# EAGLE design electronics (EAGLE 7.6.0)
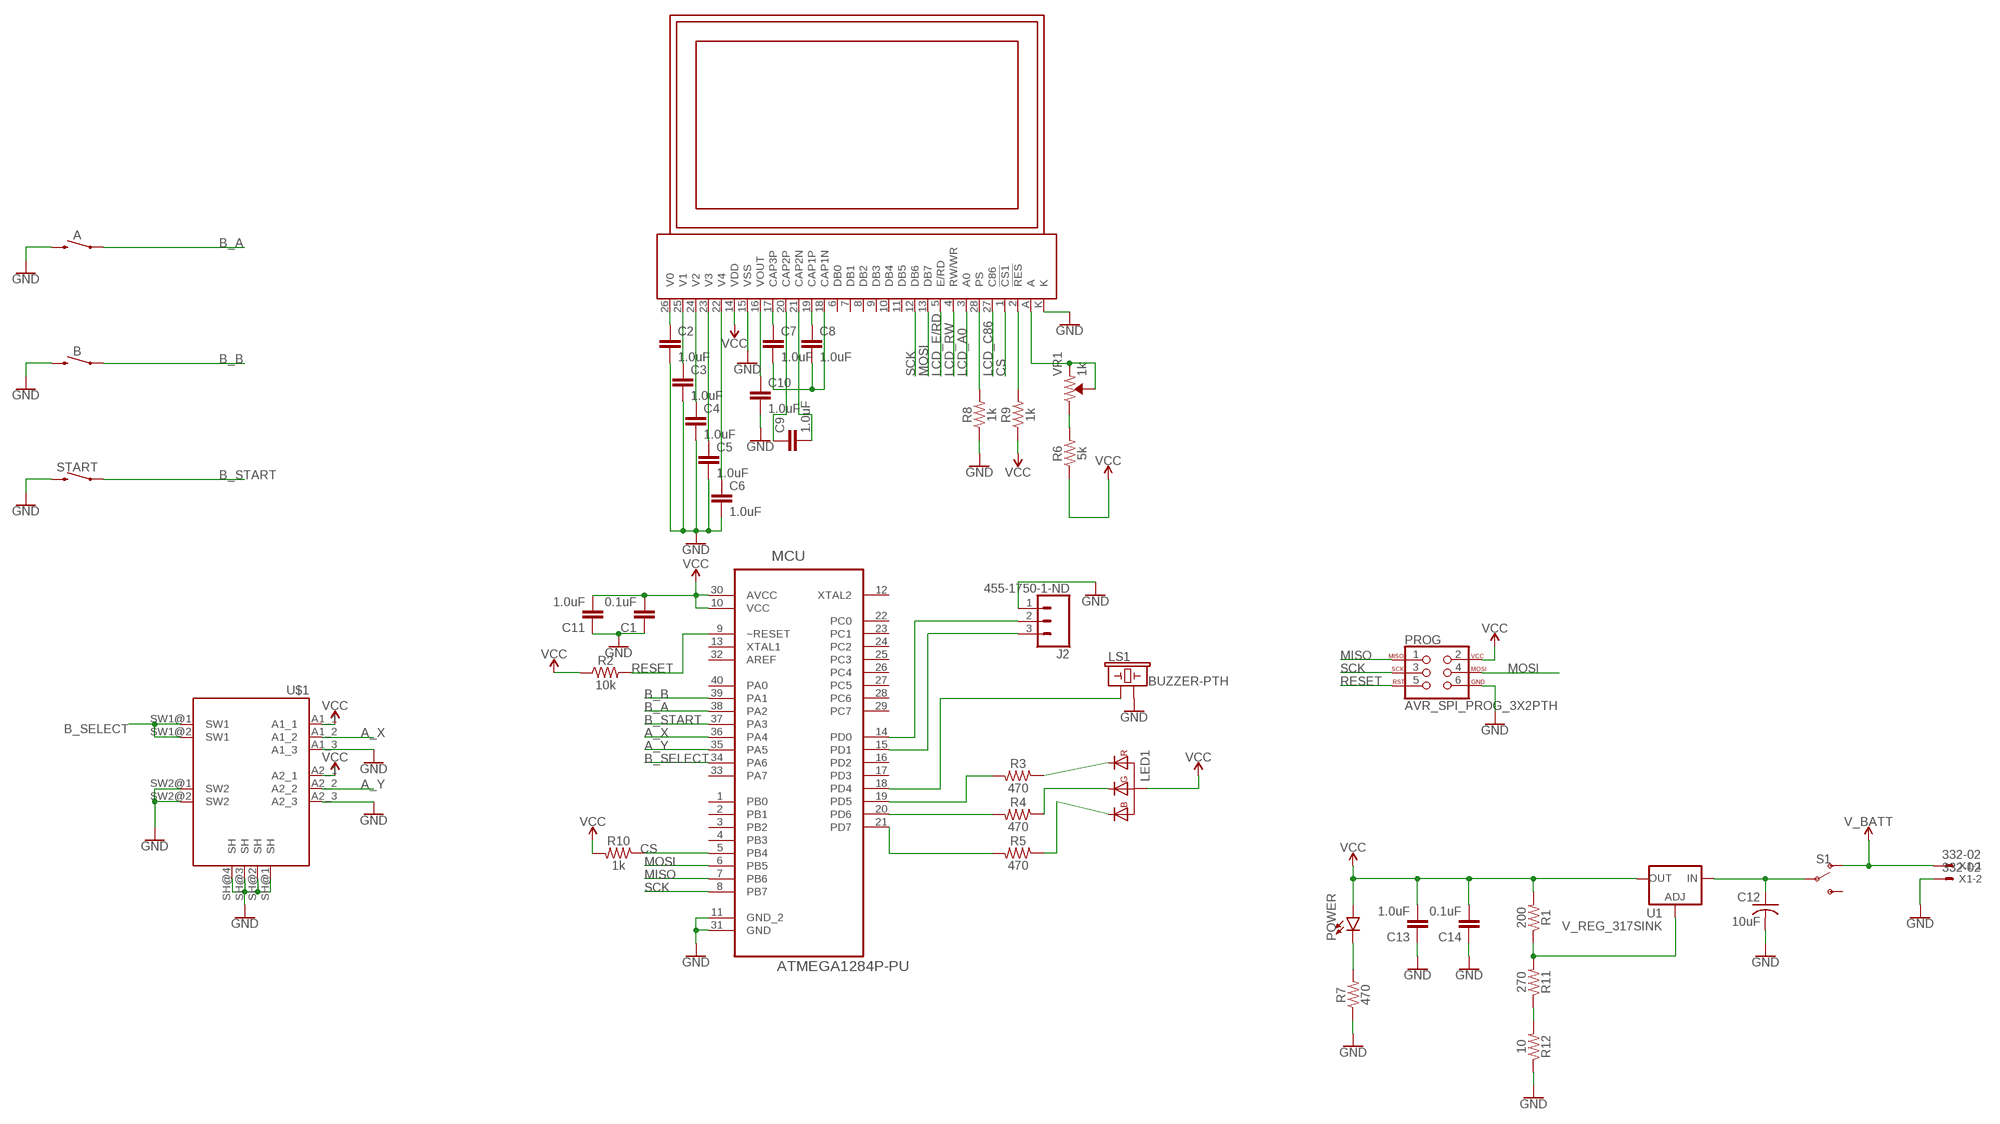
[diagram p0: schematic, sheet 1]

## Parts
A  MOMENTARY-SWITCH-SPST-PTH-6.0MM  [TACTILE_SWITCH_PTH_6.0MM]
A1  LCD  [LCD]
B  MOMENTARY-SWITCH-SPST-PTH-6.0MM  [TACTILE_SWITCH_PTH_6.0MM]
C1  0.1uF  1.0UF-0805-25V-10%  [0805]
C2  1.0uF  1.0UF-0805-25V-10%  [0805]
C3  1.0uF  1.0UF-0805-25V-10%  [0805]
C4  1.0uF  1.0UF-0805-25V-10%  [0805]
C5  1.0uF  1.0UF-0805-25V-10%  [0805]
C6  1.0uF  1.0UF-0805-25V-10%  [0805]
C7  1.0uF  1.0UF-0805-25V-10%  [0805]
C8  1.0uF  1.0UF-0805-25V-10%  [0805]
C9  1.0uF  1.0UF-0805-25V-10%  [0805]
C10  1.0uF  1.0UF-0805-25V-10%  [0805]
C11  1.0uF  1.0UF-0805-25V-10%  [0805]
C12  10uF  C-USC1206  [C1206]
C13  1.0uF  1.0UF-0805-25V-10%  [0805]
C14  0.1uF  1.0UF-0805-25V-10%  [0805]
J2  455-1750-1-ND  CONN_03  [1X03]
LED1  RGB_LED  [5MM_LED]
LS1  BUZZER-PTH  [BUZZER-12MM]
MCU  ATMEGA1284P-PU  [DIP254P1524X483-40]
POWER  LED5MM  [LED_5MM]
PROG  AVR_SPI_PROG_3X2PTH  [2X3]
R1  200  1KOHM-HORIZ-1/4W-1%  [AXIAL-0.3]
R2  10k  0.3OHM-0805-1/8W-1%  [0805]
R3  470  0.3OHM-0805-1/8W-1%  [0805]
R4  470  0.3OHM-0805-1/8W-1%  [0805]
R5  470  0.3OHM-0805-1/8W-1%  [0805]
R6  5k  0.3OHM-0805-1/8W-1%  [0805]
R7  470  0.3OHM-0805-1/8W-1%  [0805]
R8  1k  0.3OHM-0805-1/8W-1%  [0805]
R9  1k  0.3OHM-0805-1/8W-1%  [0805]
R10  1k  0.3OHM-0805-1/8W-1%  [0805]
R11  270  1KOHM-HORIZ-1/4W-1%  [AXIAL-0.3]
R12  10  1KOHM-HORIZ-1/4W-1%  [AXIAL-0.3]
S1  SWITCH-SPDT-PTH-11.6X4.0MM  [SWITCH_SPDT_PTH_11.6X4.0MM]
START  MOMENTARY-SWITCH-SPST-PTH-6.0MM  [TACTILE_SWITCH_PTH_6.0MM]
U1  V_REG_317SINK  [TO220-ADJ]
U$1  JOYSTICK  [JOY]
VR1  1k  TRIMPOT-PTH-10MM-KNOB-1/2W-10%  [TRIMPOT-PTH-3386U]
X1  332-02  [332-02]

## Nets
A_X: MCU.36(PA4) U$1.A1_2
A_Y: MCU.35(PA5) U$1.A2_2
B_A: A.1 MCU.38(PA2)
B_B: B.1 MCU.39(PA1)
B_SELECT: MCU.34(PA6) U$1.SW1@1(SW1) U$1.SW1@2(SW1)
B_START: MCU.37(PA3) START.1
CS: A1.1(!CS1) MCU.5(PB4) R10.1
GND: A1.15(VSS) A1.K A.3 B.3 C1.1 C2.2 C3.2 C4.2 C5.2 C6.2 C10.2 C11.1 C12.2 C13.1 C14.1 J2.1 LS1.- MCU.11(GND_2) MCU.31(GND) PROG.6 R7.1 R8.1 R12.P$1 START.3 U$1.A1_3 U$1.A2_3 U$1.SH@1(SH) U$1.SH@2(SH) U$1.SH@3(SH) U$1.SH@4(SH) U$1.SW2@1(SW2) U$1.SW2@2(SW2) X1.2
LCD_A0: A1.3(A0)
LCD_C86: A1.27(C86)
LCD_E/RD: A1.5(E/RD)
LCD_RW: A1.4(RW/WR)
MISO: MCU.7(PB6) PROG.1
MOSI: A1.13(DB7) MCU.6(PB5) PROG.4
N$1: A1.A VR1.1(CCW) VR1.2(WIPER)
N$2: MCU.19(PD5) R3.2
N$3: LED1.G R4.1
N$4: LED1.R R3.1
N$5: LED1.B R5.1
N$6: R6.2 VR1.3(CW)
N$7: MCU.20(PD6) R4.2
N$8: POWER.K(C) R7.2
N$9: A1.26(V0) C2.1
N$10: A1.25(V1) C3.1
N$11: A1.24(V2) C4.1
N$12: A1.23(V3) C5.1
N$13: A1.22(V4) C6.1
N$14: A1.19(CAP1P) C8.1
N$15: A1.17(CAP3P) C7.1
N$16: A1.18(CAP1N) C7.2 C8.2
N$17: A1.20(CAP2P) C9.1
N$18: A1.21(CAP2N) C9.2
N$19: A1.16(VOUT) C10.1
N$20: A1.28(PS) R8.2
N$21: A1.2(!RES) R9.2
N$22: MCU.21(PD7) R5.2
N$23: LS1.+ MCU.18(PD4)
N$24: R11.P$1 R12.P$2
N$25: J2.2 MCU.14(PD0)
N$26: J2.3 MCU.15(PD1)
N$27: C12.1 S1.2(P) U1.IN
N$28: R1.P$1 R11.P$2 U1.ADJ
RESET: MCU.9(~RESET) PROG.5 R2.2
SCK: A1.12(DB6) MCU.8(PB7) PROG.3
V_BATT: S1.1(O) X1.1
VCC: A1.14(VDD) C1.2 C11.2 C13.2 C14.2 LED1.C(A) MCU.10(VCC) MCU.30(AVCC) POWER.A PROG.2 R1.P$2 R2.1 R6.1 R9.1 R10.2 U1.OUT U$1.A1_1 U$1.A2_1
Unconnected: A1.6(DB0) A1.7(DB1) A1.8(DB2) A1.9(DB3) A1.10(DB4) A1.11(DB5) MCU.1(PB0) MCU.2(PB1) MCU.3(PB2) MCU.4(PB3) MCU.12(XTAL2) MCU.13(XTAL1) MCU.16(PD2) MCU.17(PD3) MCU.22(PC0) MCU.23(PC1) MCU.24(PC2) MCU.25(PC3) MCU.26(PC4) MCU.27(PC5) MCU.28(PC6) MCU.29(PC7) MCU.32(AREF) MCU.33(PA7) MCU.40(PA0) S1.3(S)

## Library data of the parts
A B START = SparkFun-Switches:MOMENTARY-SWITCH-SPST: Momentary Switch (Pushbutton) - SPST Normally-open (NO) SPST momentary switches (buttons, pushbuttons). Variants PTH-12MM - 12mm square, through-hole Momentary Pushbutton Switch - 12mm Square <https://www.sparkfun.com/products/9190> (COM-09190) PTH-6.0MM, PTH-6.0MM-KIT - 6.0mm square, through-hole Mini Pushbutton Switch <https://www.sparkfun.com/products/97> (COM-00097) KIT package intended for soldering kit's - only one side of pads' copper is exposed. PTH-RIGHT-ANGLE-KIT - Right-angle, through-hole Right Angle Tactile Button <https://www.sparkfun.com/products/10791> - Used on SparkFun BigTime Watch Kit <https://www.sparkfun.com/products/11734> SMD-12MM - 12mm square, surface-mount Tactile Button - SMD (12mm) <https://www.sparkfun.com/products/12993> (COM-12993) Used on SparkFun PicoBoard <https://www.sparkfun.com/products/11888> SMD-4.5MM - 4.5mm Square Trackball Switch Used on SparkFun Blackberry Trackballer Breakout <https://www.sparkfun.com/products/13169> SMD-4.6MMX2.8MM - 4.60mm x 2.80mm, surface mount Used on SparkFun SAMD21 Mini Breakout <https://www.sparkfun.com/products/13664> SMD-5.2MM, SMD-5.2-REDUNDANT - 5.2mm square, surface-mount Mini Pushbutton Switch - SMD <https://www.sparkfun.com/products/8720> (COM-08720) Used on Arduino Pro Mini <https://www.sparkfun.com/products/11114> REDUNDANT package connects both switch circuits together SMD-6.0X3.5MM - 6.0 x 3.5mm, surface mount Momentary Reset Switch SMD <https://www.sparkfun.com/products/8229> (COM-08229) SMD-6.2MM-TALL - 6.2mm square, surface mount Tactile Button - SMD (6mm) <https://www.sparkfun.com/products/12992> Used on SparkFun Digital Sandbox <https://www.sparkfun.com/products/12651> SMD-RIGHT-ANGLE - Right-angle, surface mount Used on SparkFun Block for Intel® Edison - Arduino <https://www.sparkfun.com/products/13036>; PROD_ID: SWCH-08441; SF_SKU: COM-00097
A1 = lcd:LCD: Newhaven NHD-C12864LZ
C1 C14 = SparkFun-Capacitors:1.0UF: 1µF ceramic capacitors A capacitor is a passive two-terminal electrical component used to store electrical energy temporarily in an electric field.; PROD_ID: CAP-08064; VALUE: 1.0uF
C2-C11 C13 = SparkFun-Capacitors:1.0UF: 1µF ceramic capacitors A capacitor is a passive two-terminal electrical component used to store electrical energy temporarily in an electric field.; PROD_ID: CAP-08064
C12 = rcl:C-US: CAPACITOR, American symbol
J2 = SparkFun-Connectors:CONN_03: Multi connection point. Often used as Generic Header-pin footprint for 0.1 inch spaced/style header connections On any of the 0.1 inch spaced packages, you can populate with these: Break Away Headers - Straight <https://www.sparkfun.com/products/116> (PRT-00116) Break Away Male Headers - Right Angle <https://www.sparkfun.com/products/553> (PRT-00553) Female Headers <https://www.sparkfun.com/products/115> (PRT-00115) Break Away Headers - Machine Pin <https://www.sparkfun.com/products/117> (PRT-00117) Break Away Female Headers - Swiss Machine Pin <https://www.sparkfun.com/products/743> (PRT-00743) Stackable Header - 3 Pin (Female, 0.1") <https://www.sparkfun.com/products/13875> (PRT-13875) For SCREWTERMINALS and SPRING TERMINALS visit here: Screw Terimnals on SparkFun.com <https://www.sparkfun.com/search/results?term=Screw+Terminals> (5mm/3.5mm/2.54mm spacing) This device is also useful as a general connection point to wire up your design to another part of your project. Our various solder wires solder well into these plated through hole pads. Hook-Up Wire - Assortment (Stranded, 22 AWG) <https://www.sparkfun.com/products/11375> (PRT-11375) Hook-Up Wire - Assortment (Solid Core, 22 AWG) <https://www.sparkfun.com/products/11367> (PRT-11367) View the entire wire category on our website here <https://www.sparkfun.com/categories/141> Special notes: Molex polarized connector foot print use with SKU : PRT-08232 with associated crimp pins and housings.; PROD_ID: XXX-00000
LED1 = Keshav Standard:RGB_LED: RGB LED with bigger lead spacing
LS1 = SparkFun-Electromechanical:BUZZER: Buzzer Small round buzzers that operate around the audible 2kHz range. You can use these as speakers to create simple music or user interfaces. Variant Overview: PTH - Mini Speaker - PC Mount 12mm 2.048kHz <https://www.sparkfun.com/products/7950> PTH_KIT - Mini Speaker - PC Mount 12mm 2.048kHz <https://www.sparkfun.com/products/7950> KIT simplifies soldering by adding stop mask to one side of the pads. PTH_NO_SILK - Mini Speaker - PC Mount 12mm 2.048kHz <https://www.sparkfun.com/products/7950> No silkscreen indicator of buzzer outline. PTH_KIT_NO_SILK - Mini Speaker - PC Mount 12mm 2.048kHz <https://www.sparkfun.com/products/7950> KIT package w/o silkscreen SMD - Buzzer Audio Magnetic (CCV-084B16) SMD buzzer used on, e.g. the LilyPad Buzzer <https://www.sparkfun.com/products/8463> and RFID USB Reader <https://www.sparkfun.com/products/9963>. SMD_KIT - Buzzer Audio Magnetic (CCV-084B16) SMD Buzzer with elongated pins to make soldering easier. Used on the SparkFun Simon Says - Surface Mount Soldering Kit <https://www.sparkfun.com/products/10935>.; PROD_ID: COMP-08253; SF_SKU: COM-07950
MCU = ATMEGA1284P-PU:ATMEGA1284P-PU: 8-bit Microcontroller with In-System Programmable Flash; AVAILABILITY: Good; DESCRIPTION: ATmega Series 20 MHz 128 KB Flash 16 KB SRAM 8-Bit Microcontroller - DIP-40; MF: Microchip; MP: ATMEGA1284P-PU; PACKAGE: PDIP-40 Microchip; PRICE: 5.25 USD
POWER = SparkFun-LED:LED: LED (Generic) Standard schematic elements and footprints for 5mm, 3mm, 1206, and 0603 sized LEDs. Generic LEDs with no color specified.
PROG = SparkFun-Connectors:AVR_SPI_PROG_3X2: AVR ISP 6 Pin This is the reduced ISP connector for AVR programming. Common on Arduino. This footprint will take up less PCB space and can be used with a 10-pin to 6-pin adapter such as SKU: BOB-08508 **Special note about "TEST_POINT" package. The stop mask is on the top side, so if you want your programming test points to be on the bottom of your board, make sure to place this package on the bottom side of the board. This also ensure that the orientation to program from the bottom side will be correct. SparkFun Products: SparkFun ISP Pogo Adapter <https://www.sparkfun.com/products/11591> - NS Tiny AVR Programmer <https://www.sparkfun.com/products/11801> -PTH
R1 R11 R12 = SparkFun-Resistors:1KOHM: 1kΩ resistor A resistor is a passive two-terminal electrical component that implements electrical resistance as a circuit element. Resistors act to reduce current flow, and, at the same time, act to lower voltage levels within circuits. - Wikipedia; PROD_ID: RES-12182; VALUE: 1k
R2-R10 = SparkFun-Resistors:0.3OHM: 0.3Ω resistor A resistor is a passive two-terminal electrical component that implements electrical resistance as a circuit element. Resistors act to reduce current flow, and, at the same time, act to lower voltage levels within circuits. - Wikipedia; PROD_ID: RES-11622; VALUE: 0.3
S1 = SparkFun-Switches:SWITCH-SPDT: Single Pole, Double Throw (SPDT) Switch Single-pole, double-throw (SPDT) switch. Variant Overview SMD-AYZ0202 Surface Mount DPDT Switch <https://www.sparkfun.com/products/597> (COM-00597) Used on e.g. LilyPad Arduino USB - ATmega32U4 Board <https://www.sparkfun.com/products/12049> PTH-11.6X4.0MM SPDT Mini Power Switch <https://www.sparkfun.com/products/102> (COM-00102) Used on e.g. SparkFun Simon Says - Through-Hole Soldering Kit <https://www.sparkfun.com/products/10547> (KIT-10547) PTH-11.6X4.0MM-KIT KIT version of SPDT Mini Power Switch - Simplifies soldering by removing tStop of switch pins - only one side can be soldered. PTH-11.6X4.0MM-LOCK LOCK version of SPDT Mini Power Switch - Offset pins hold switch in place for easier soldering. SMD-RIGHT-ANGLE Surface Mount Right Angle Switch <https://www.sparkfun.com/products/10860> (COM-10860) Used on e.g. SparkFun ESP8266 Thing <https://www.sparkfun.com/products/13231>; PROD_ID: SWCH-08261; SF_SKU: COM-00102
U1 = SparkFun-IC-Power:V_REG_317: Voltage Regulator Standard LM317 adjustable voltage regulator. AOI (Adjust Output Input). Google 'LM317 Calculator' for easy to use app to get the two resistor values needed. 240/720 for 5V output. 240/390 for 3.3V output. Spark Fun Electronics SKU : COM-00527
U$1 = joystick:JOYSTICK
VR1 = SparkFun-Resistors:TRIMPOT: Trimming Potentiometer (Trimpot) Three-terminal potentiometers, with an adjustable wiper and two adjustable resistors. A pot can be used to create a configurable voltage divider, or as a variable resistor. "Trimpots" are a subset of potentiometers, usually intended for "set-and-forget" applications. They're often more delicate than standard potentiometers - rated for fewer turns. Variants PTH-KNOB - PTH Trimpot w/ finger-adjustable knob Trimpot 10K with Knob <https://www.sparkfun.com/products/9806> (COM-09806) Datasheet <http://www.sparkfun.com/datasheets/Components/General/TSR-3386.pdf> SMD-3MM-CLOSED-FRAME - SMD 3mm Square Closed-Frame Trimpot Used on e.g. EasyDriver - Stepper Motor Driver <https://www.sparkfun.com/products/12779> Datasheet <http://www.bitechnologies.com/pdfs/22.pdf> (22AR10KTR) SMD-5MM - SMD 5mm Square Closed-Frame Trimpot Used on e.g. IOIO-OTG - V2.2 <https://www.sparkfun.com/products/13613> Datasheet <http://www.vishay.com/docs/51008/ts53.pdf> (TS53YL502MR10) SMD-3MM-1/10W-25% - 3mm Square Open-Frame Trimpot Used on e.g. SparkFun Shapeoko <https://www.sparkfun.com/products/13899> Datasheet <http://www.bourns.com/docs/Product-Datasheets/TC33.pdf> (TC33X-2-103E); PROD_ID: RES-09730; SF_SKU: COM-09806; VALUE: 10k
X1 = con-garry:332-02: 2 Pin - 2mm Dual Row Source: www.mpe-connector.de / garry_shortform_2012.pdf

## Board
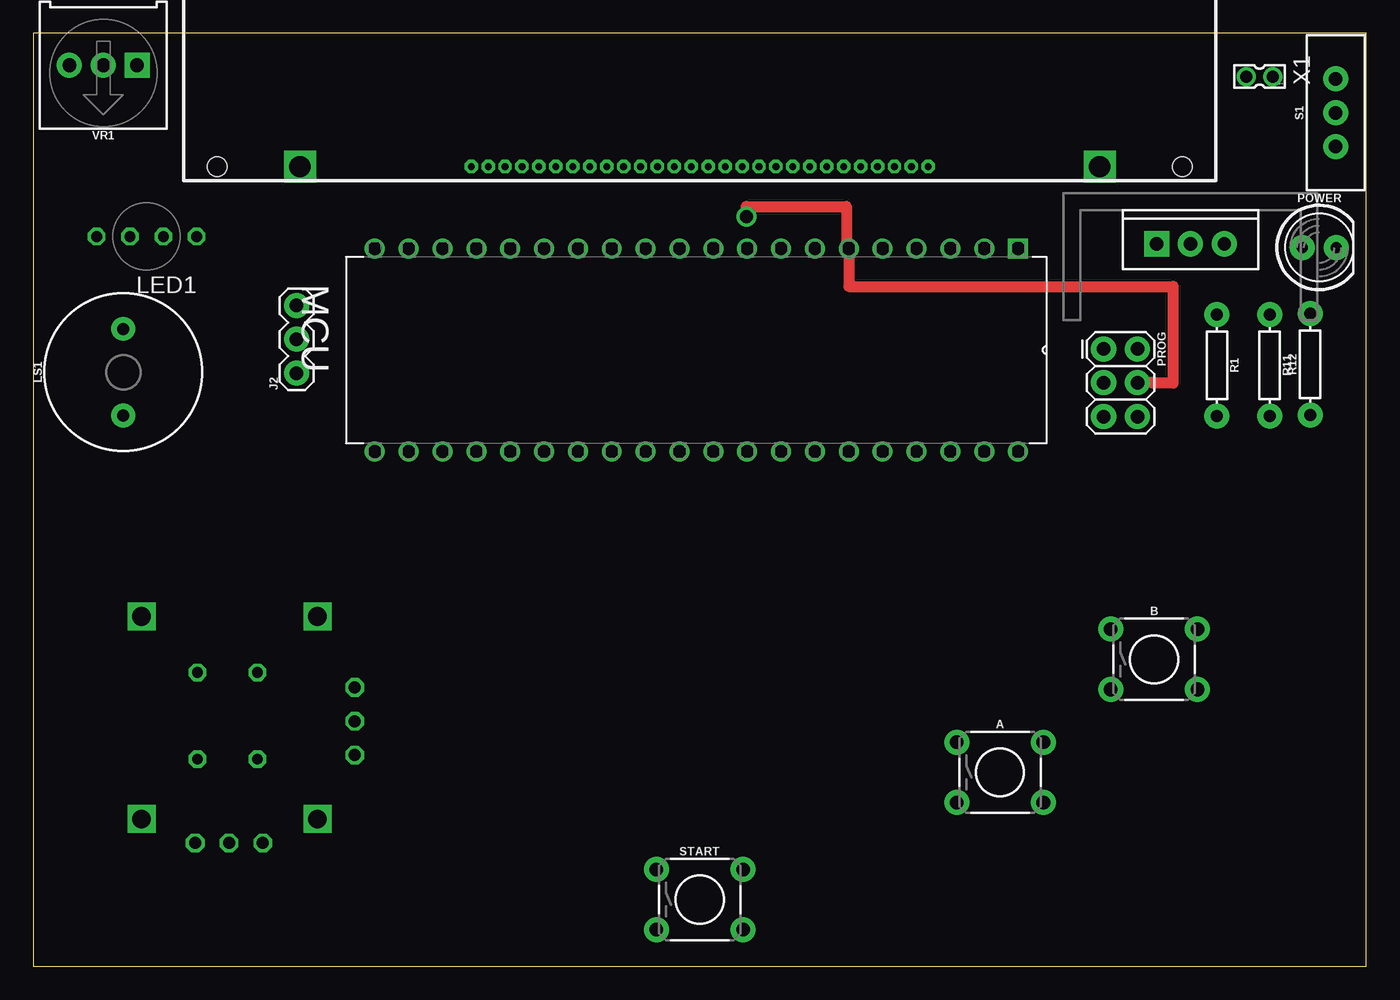
[diagram p1: board, top side]
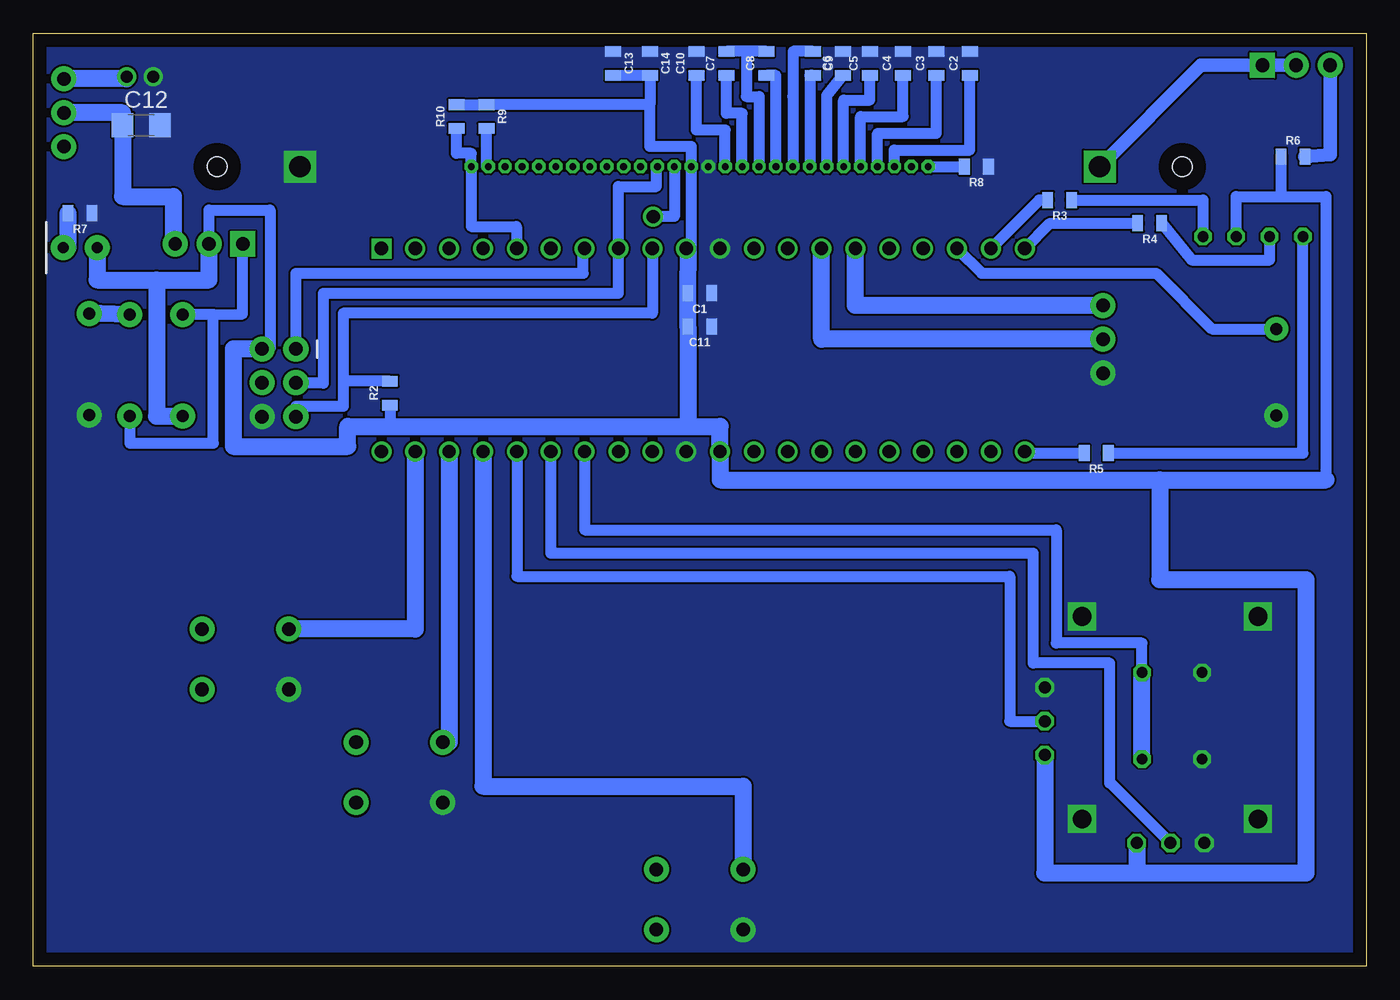
[diagram p2: board, bottom side, seen from below]

Size 100 x 70 mm. Coordinates in mm from the lower left corner, seen from the top.
Outline: 0,0 100,0 100,70 0,70 0,0
Copper layers (1*16): Top 0.035mm / dielectric 1.5mm / Bottom 0.035mm
Design rules "default": minimum track width 6mil, minimum drill 0.35mm, track to track 6mil, track to pad 6mil, pad to pad 6mil, via to via 6mil, smd to smd 6mil, copper to edge 40mil, drill to drill 6mil, minimum pad ring 10mil, minimum via ring 8mil, stop-mask expansion 4mil, vias tented up to drill 0mil, thermal gap 10mil

### Footprints (pad centres in the part's own frame; a part is rotated, then mirrored left to right if it is on the bottom)
TACTILE_SWITCH_PTH_6.0MM = drill 1.016 pad 1.88: 1 -3.251,2.261; 2 3.251,2.261; 3 -3.251,-2.261; 4 3.251,-2.261
LCD = drill 0.5 octagon: 1 17.145,0; 2 15.875,0; 3 14.605,0; 4 13.335,0; 5 12.065,0; 6 10.795,0; 7 9.525,0; 8 8.255,0; 9 6.985,0; 10 5.715,0; 11 4.445,0; 12 3.175,0; 13 1.905,0; 14 0.635,0; 15 -0.635,0; 16 -1.905,0; 17 -3.175,0; 18 -4.445,0; 19 -5.715,0; 20 -6.985,0; 21 -8.255,0; 22 -9.525,0; 23 -10.795,0; 24 -12.065,0; 25 -13.335,0; 26 -14.605,0; 27 -15.875,0; 28 -17.145,0 | drill 1.6 square: A -30,0; K 30,0 | hole 1.5: -36.2,0; 36.2,0
0805 = smd 0.8 x 1.2: 1 -0.9,0; 2 0.9,0
C1206 = smd 1.6 x 1.8: 1 -1.4,0; 2 1.4,0
1X03 = drill 1.016 pad 1.88: 1 0,0; 2 2.54,0; 3 5.08,0
5MM_LED = drill 0.8 octagon: B 3.75,0; C -1.25,0; G 1.25,0; R -3.75,0
BUZZER-12MM = drill 0.9 pad 1.778: + 3.25,0; - -3.25,0
DIP254P1524X483-40 = drill 0.991 square: 1 -15.24,48.26 | drill 0.991: 2 -15.24,45.72; 3 -15.24,43.18; 4 -15.24,40.64; 5 -15.24,38.1; 6 -15.24,35.56; 7 -15.24,33.02; 8 -15.24,30.48; 9 -15.24,27.94; 10 -15.24,25.4; 11 -15.24,22.86; 12 -15.24,20.32; 13 -15.24,17.78; 14 -15.24,15.24; 15 -15.24,12.7; 16 -15.24,10.16; 17 -15.24,7.62; 18 -15.24,5.08; 19 -15.24,2.54; 20 -15.24,0; 21 0,0; 22 0,2.54; 23 0,5.08; 24 0,7.62; 25 0,10.16; 26 0,12.7; 27 0,15.24; 28 0,17.78; 29 0,20.32; 30 0,22.86; 31 0,25.4; 32 0,27.94; 33 0,30.48; 34 0,33.02; 35 0,35.56; 36 0,38.1; 37 0,40.64; 38 0,43.18; 39 0,45.72; 40 0,48.26
LED_5MM = drill 0.813 pad 1.88: A -1.27,0; K 1.27,0
2X3 = drill 1.016 pad 1.88: 1 0,0; 2 0,2.54; 3 2.54,0; 4 2.54,2.54; 5 5.08,0; 6 5.08,2.54
AXIAL-0.3 = drill 0.9 pad 1.88: P$1 -3.81,0; P$2 3.81,0
SWITCH_SPDT_PTH_11.6X4.0MM = drill 1.016 pad 1.88: 1 0,2.54; 2 0,0; 3 0,-2.54
TO220-ADJ = drill 1 pad 1.88 square: ADJ -2.54,0 | drill 1 pad 1.88: IN 2.54,0; OUT 0,0
JOY = drill 0.9 octagon: A1_1 -7.3,6.2; A1_2 -7.3,3.66; A1_3 -7.3,1.12; A2_1 -0.4,12.8; A2_2 2.14,12.8; A2_3 4.68,12.8 | drill 1.4 square: SH@1 -4.5,11; SH@2 8.7,11; SH@3 -4.5,-4.2; SH@4 8.7,-4.2 | drill 0.8 octagon: SW1@1 0,6.5; SW1@2 0,0; SW2@1 4.5,6.5; SW2@2 4.5,0
TRIMPOT-PTH-3386U = drill 1.016 pad 1.88 square: 1 -2.54,-0.015 | drill 1.016 pad 1.88: 2 0,-0.015; 3 2.54,-0.015
332-02 = drill 0.9 pad 1.27: 1 0,-1; 2 0,1

### Placement (x,y rotation side)
A  72.53,14.54 0 top
A1  50,60 0 top
B  84.09,23.03 0 top
C1  50,50.5 180 bottom
C2  29.75,67.75 90 bottom
C3  32.25,67.75 90 bottom
C4  34.75,67.75 90 bottom
C5  37.25,67.75 90 bottom
C6  39.25,67.75 90 bottom
C7  48,67.75 90 bottom
C8  45,67.75 90 bottom
C9  41.5,67.75 270 bottom
C10  50.25,67.75 90 bottom
C11  50,48 180 bottom
C12  91.9,63.11 0 bottom
C13  56.5,67.75 270 bottom
C14  53.75,67.75 270 bottom
J2  19.75,44.5 90 top
LED1  8.5,54.75 180 top
LS1  6.75,44.57 90 top
MCU  25.62,38.62 270 top
POWER  96.48,53.93 0 top
PROG  80.3,46.32 270 top
R1  88.81,45.09 270 top
R2  73.25,43 90 bottom
R3  23,57.5 180 bottom
R4  16.25,55.75 180 bottom
R5  20.25,38.5 180 bottom
R6  5.5,60.75 0 bottom
R7  96.5,56.5 180 bottom
R8  29.25,60 180 bottom
R9  66,63.75 270 bottom
R10  68.25,63.75 90 bottom
R11  92.76,45.09 270 top
R12  95.79,45.16 90 top
S1  97.71,64.04 0 top
START  50,5 0 top
U1  86.82,54.2 0 top
U$1  16.82,22.04 180 top
VR1  5.25,67.59 180 top
X1  92,66.75 90 top

### Tracks (layer width: path | path; a pad name or v marks a point on that pad's centre or on a via)
A_X
  Bottom 0.813: MCU.36 63.72,29.25 26.75,29.25 26.75,18.38 U$1.A1_2
A_Y
  Bottom 0.813: U$1.A2_2 19.19,13.75 19.25,13.75 19.25,22.75 25,22.75 25,31 61.18,31 MCU.35
B_A
  Bottom 1.27: MCU.38 68.8,16.8 A.1
B_B
  Bottom 1.27: MCU.39 71.34,25.29 B.1
B_SELECT
  Bottom 0.813: U$1.SW1@2 16.82,24.25 23.25,24.25 23.25,32.75 58.64,32.75 MCU.34
  Bottom 1.27: U$1.SW1@1 U$1.SW1@2
B_START
  Bottom 0.813: START.1
  Bottom 1.27: MCU.37 66.26,13.5 46.75,13.5 START.1
CS
  Bottom 0.813: MCU.5 63.75,53.86 63.75,55.5 67.14,55.5 A1.1 67.14,61 68.25,61 R10.1
GND
  pour Bottom (no thermals): 0,0 100,0 100,70 0,70
MISO
  Bottom 0.813: PROG.1 80.3,52 58.75,52 58.75,53.86 MCU.7
MOSI  (via drill 1)
  Top 0.813: v53.5,56.25 53.5,57 61,57 61,53.86 MCU.6 61.18,51 85.5,51 85.5,43.75 84,43.75 84,43.78 PROG.4
  Bottom 0.813: A1.13 51.91,56.25 v53.5,56.25
N$1
  Bottom 1.016: A1.A 12.39,67.61 VR1.1 VR1.2
N$2
  Bottom 0.813: R3.2 24.52,57.5 MCU.19
N$3
  Bottom 0.813: R4.1 13.1,53 7.25,53 LED1.G
N$4
  Bottom 0.813: R3.1 12.25,57.5 LED1.R
N$5
  Bottom 0.813: R5.1 4.75,38.5 LED1.B
N$6
  Bottom 1.016: VR1.3 2.71,60.89 R6.2
N$7
  Bottom 0.813: MCU.20 23.73,55.75 R4.2
N$8
  Bottom 1.27: R7.2 97.4,53.93 POWER.K
N$9
  Bottom 0.813: A1.26 35.4,61.25 29.75,61.25 C2.1
N$10
  Bottom 0.813: A1.25 36.66,62.5 32.25,62.5 C3.1
N$11
  Bottom 0.813: A1.24 37.94,63.75 34.75,63.75 C4.1
N$12
  Bottom 0.813: A1.23 39.2,65 37.25,65 C5.1
N$13
  Bottom 0.813: A1.22 40.48,65.35 C6.1
N$14
  Bottom 0.813: A1.19 44.28,66.85 C8.1
N$15
  Bottom 0.813: A1.17 46.83,64 48,64 C7.1
N$16
  Bottom 0.813: C8.2 46.5,68.65 | 46.5,68.65 46.5,65.25 45.55,65.25 A1.18 | 46.5,68.65 C7.2
N$17
  Bottom 0.813: C9.1 43,68.65 43,65.25 43.02,65.25 A1.20
N$18
  Bottom 0.813: C9.2 41.74,66.85 A1.21
N$19
  Bottom 0.813: A1.16 48.09,62.75 50.25,62.75 C10.1
N$20
  Bottom 0.813: A1.28 R8.2
N$21
  Bottom 0.813: A1.2 66,60 R9.2
N$22
  Bottom 0.813: MCU.21 25.62,38.5 R5.2
N$23
  Bottom 0.813: MCU.18 28.84,52 15.75,52 11.57,47.82 LS1.+
N$24
  Bottom 1.27: R11.P$1 95.01,48.97 R12.P$2
N$25
  Bottom 1.27: J2.2 40.86,47.04 MCU.14
N$26
  Bottom 1.27: J2.3 38.32,49.58 MCU.15
N$27
  Bottom 0.813: 89.5,54.2 U1.IN
  Bottom 1.27: S1.2 93.3,64.04 C12.1 93.3,57.75 89.5,57.75 89.5,54.2
N$28
  Bottom 0.813: U1.ADJ 84.31,48.95 R1.P$1 86.5,48.9 86.5,39.25 92.76,39.25 R11.P$2
RESET
  Bottom 0.813: MCU.9 53.56,49 76.75,49 76.75,43.9 | 76.75,43.9 76.75,42 80.3,42 PROG.5 | R2.2 76.75,43.9
SCK
  Bottom 0.813: PROG.3 80.3,43.75 78.25,43.75 78.25,50.5 56.1,50.5 MCU.8 56.1,58.5 53.25,58.5 53.25,60 A1.12
V_BATT
  Bottom 1.27: X1.1 93,66.58 S1.1
VCC
  Bottom 0.813: MCU.10 50.85,53.86 arc-90 50.63,54.08 A1.14 50.63,61.5 53.75,61.5 53.75,64.65 | 53.75,64.65 R9.1 R10.2 | C13.2 C14.2 53.75,64.65 | R2.1 73.25,40.5 | 3,36.5 3,57.75 6.4,57.75 | LED1.C 9.75,57.75 6.4,57.75 | R6.1 6.4,57.75 | U1.OUT 86.82,56.75 82.25,56.75 82.25,46.32 PROG.2
  Bottom 1.27: 50.85,53.86 C1.2 C11.2 50.9,40.5 | 90.75,51.5 90.75,41.28 R1.P$2 | POWER.A 95.21,51.5 90.75,51.5 | 90.75,51.5 86.82,51.5 U1.OUT | 50.9,40.5 73.25,40.5 76.41,40.5 76.41,39 85,39 85,46.32 PROG.2 | 50.9,40.5 48.48,40.5 MCU.30 48.48,36.5 15.5,36.5 | U$1.A2_1 17.22,7 | 17.22,7 4.5,7 4.5,29 15.5,29 15.5,36.5 | U$1.A1_1 24.12,7 17.22,7 | 15.5,36.5 3,36.5